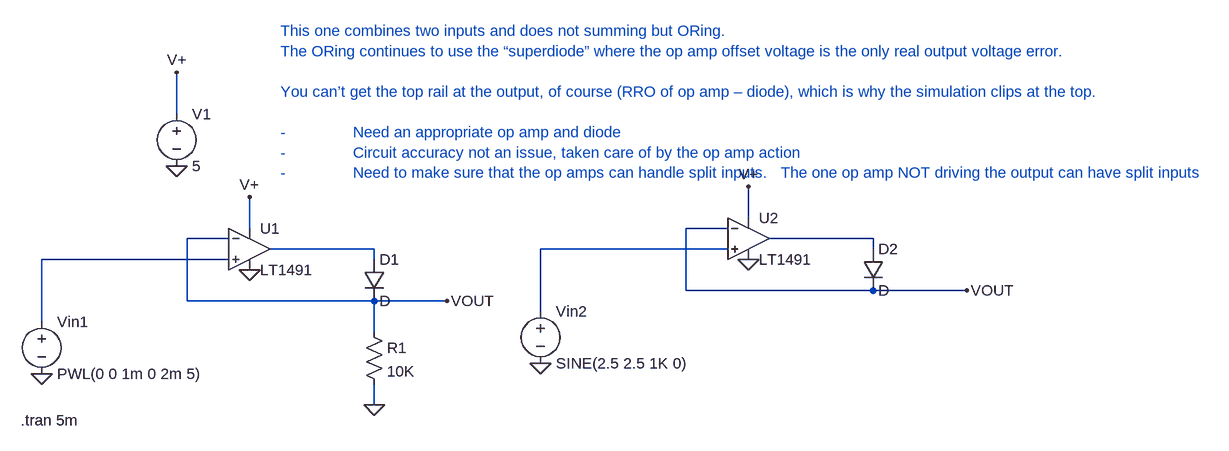
[diagram p0: schematic Superdiode_twoinputs.asc]
Superdiode_twoinputs.asc, the LTspice schematic file:
Version 4
SHEET 1 1716 680
WIRE 64 -48 64 -112
WIRE 944 112 944 64
WIRE 176 128 176 80
WIRE 912 128 848 128
WIRE 144 144 80 144
WIRE 1136 144 976 144
WIRE 368 160 208 160
WIRE 912 160 624 160
WIRE 1136 160 1136 144
WIRE 144 176 -144 176
WIRE 368 176 368 160
WIRE 848 224 848 128
WIRE 1136 224 848 224
WIRE 1280 224 1136 224
WIRE 80 240 80 144
WIRE 368 240 80 240
WIRE 480 240 368 240
WIRE 624 256 624 160
WIRE -144 272 -144 176
WIRE 368 288 368 240
WIRE 368 400 368 368
FLAG 368 400 0
FLAG 176 192 0
FLAG 64 32 0
FLAG 64 -112 V+
FLAG 176 80 V+
FLAG -144 352 0
FLAG 944 176 0
FLAG 944 64 V+
FLAG 624 336 0
FLAG 480 240 VOUT
FLAG 1280 224 VOUT
SYMBOL diode 352 176 R0
SYMATTR InstName D1
SYMBOL res 352 272 R0
SYMATTR InstName R1
SYMATTR Value 10K
SYMBOL voltage 64 -64 R0
WINDOW 123 0 0 Left 2
WINDOW 39 0 0 Left 2
SYMATTR InstName V1
SYMATTR Value 5
SYMBOL voltage -144 256 R0
WINDOW 123 0 0 Left 2
WINDOW 39 0 0 Left 2
SYMATTR InstName Vin1
SYMATTR Value PWL(0 0 1m 0 2m 5)
SYMBOL diode 1120 160 R0
SYMATTR InstName D2
SYMBOL voltage 624 240 R0
WINDOW 123 0 0 Left 2
WINDOW 39 0 0 Left 2
SYMATTR InstName Vin2
SYMATTR Value SINE(2.5 2.5 1K 0)
SYMBOL Opamps\\LT1491 176 96 R0
SYMATTR InstName U1
SYMBOL Opamps\\LT1491 944 80 R0
SYMATTR InstName U2
TEXT -176 424 Left 2 !.tran 5m
TEXT 224 -176 Left 2 ;This one combines two inputs and does not summing but ORing.\nThe ORing continues to use the “superdiode” where the op amp offset voltage is the only real output voltage error.\n \nYou can’t get the top rail at the output, of course (RRO of op amp – diode), which is why the simulation clips at the top.\n \n-               Need an appropriate op amp and diode\n-               Circuit accuracy not an issue, taken care of by the op amp action\n-               Need to make sure that the op amps can handle split inputs.   The one op amp NOT driving the output can have split inputs

The netlist it stands for:
* Superdiode_twoinputs.asc
D1 N002 VOUT D
R1 VOUT 0 10K
V1 V+ 0 5
Vin1 N004 0 PWL(0 0 1m 0 2m 5)
D2 N001 VOUT D
Vin2 N003 0 SINE(2.5 2.5 1K 0)
XU1 N004 VOUT V+ 0 N002 LT1491  ; pins In+ In- V+ V- OUT
XU2 N003 VOUT V+ 0 N001 LT1491  ; pins In+ In- V+ V- OUT
.model D D
.lib standard.dio
.tran 5m
* This one combines two inputs and does not summing but ORing.
* The ORing continues to use the “superdiode” where the op amp offset voltage is the only real output voltage error.
* You can’t get the top rail at the output, of course (RRO of op amp – diode), which is why the simulation clips at the top.
* -               Need an appropriate op amp and diode
* -               Circuit accuracy not an issue, taken care of by the op amp action
* -               Need to make sure that the op amps can handle split inputs.   The one op amp NOT driving the output can have split inputs
.backanno
.end